# EAGLE design FlexWatch (EAGLE 9.5.0)
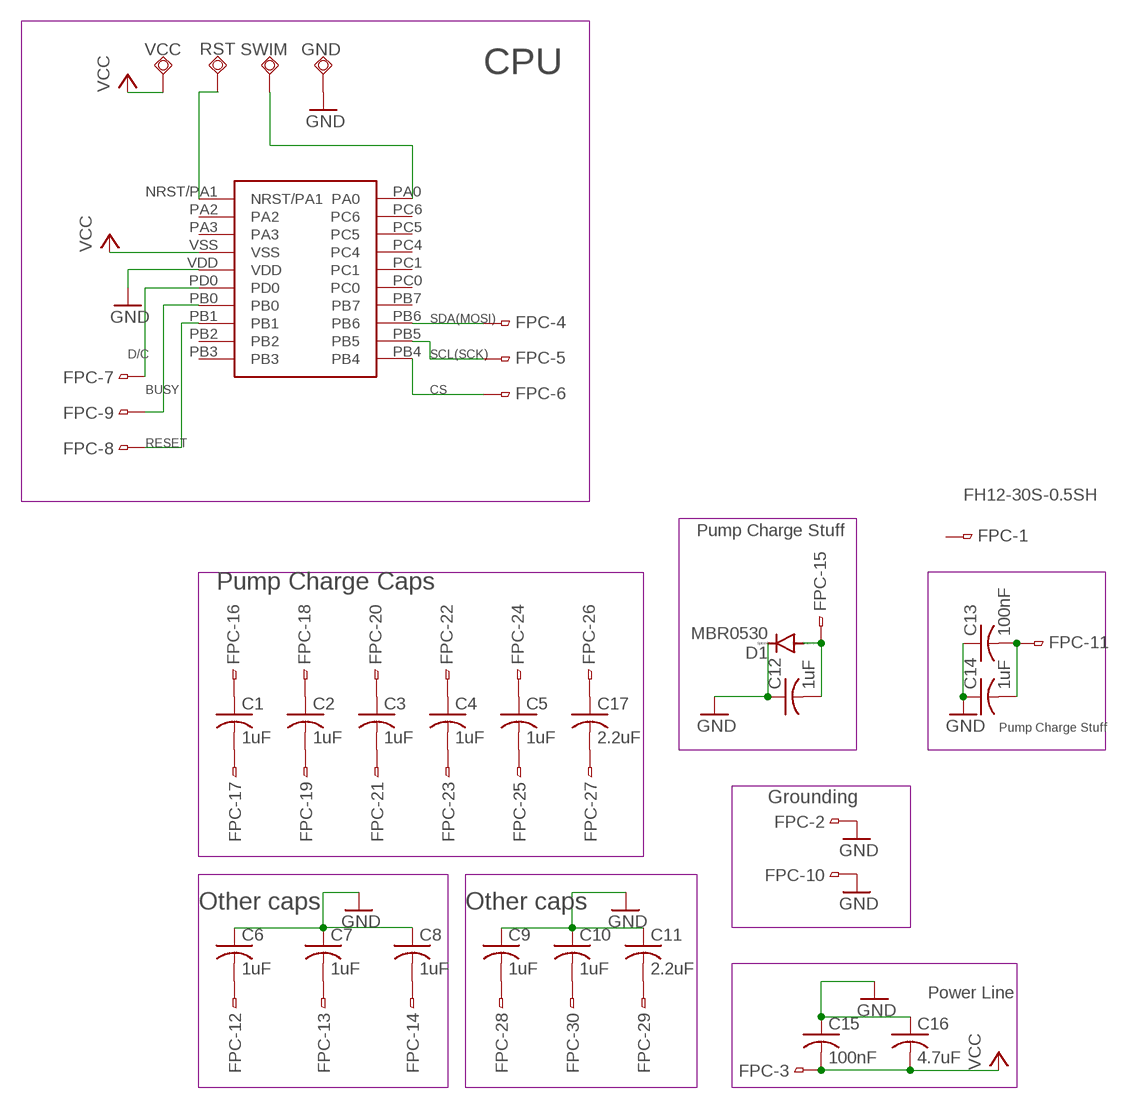
[diagram p0: schematic, sheet 1]

## Parts
C1  1uF  C-USC0805  [C0805]
C2  1uF  C-USC0805  [C0805]
C3  1uF  C-USC0805  [C0805]
C4  1uF  C-USC0805  [C0805]
C5  1uF  C-USC0805  [C0805]
C6  1uF  C-USC0805  [C0805]
C7  1uF  C-USC0805  [C0805]
C8  1uF  C-USC0805  [C0805]
C9  1uF  C-USC0805  [C0805]
C10  1uF  C-USC0805  [C0805]
C11  2.2uF  C-USC1206  [C1206]
C12  1uF  C-USC0805  [C0805]
C13  100nF  C-USC0805  [C0805]
C14  1uF  C-USC0805  [C0805]
C15  100nF  C-USC0805  [C0805]
C16  4.7uF  C-USC0805  [C0805]
C17  2.2uF  C-USC1206  [C1206]
D1  MBR0530  CGRM4001-G  [SOD-123_MINI-SMA]
FPC  FH12-30S-0.5SH  [FH12-30S-0.5SH]
GND  TPSQTP18SQ  [TP18SQ]
RST  TPSQTP18SQ  [TP18SQ]
SWIM  TPSQTP18SQ  [TP18SQ]
U$1  STM8L151F3  [UFQFPN-20]
VCC  TPSQTP18SQ  [TP18SQ]

## Nets
BUSY: FPC.9 U$1.PB0
CS: FPC.6 U$1.PB4
D/C: FPC.7 U$1.PD0
GND: C6.1 C7.1 C8.1 C9.1 C10.1 C11.1 C12.1 C13.1 C14.1 C15.1 C16.1 D1.C FPC.2 FPC.10 GND.TP U$1.VDD
N$1: C1.1 FPC.16
N$2: C1.2 FPC.17
N$3: C2.1 FPC.18
N$4: C2.2 FPC.19
N$5: C3.1 FPC.20
N$6: C3.2 FPC.21
N$7: C4.1 FPC.22
N$8: C4.2 FPC.23
N$9: C5.1 FPC.24
N$10: C5.2 FPC.25
N$11: C6.2 FPC.12
N$12: C7.2 FPC.13
N$13: C8.2 FPC.14
N$14: C12.2 D1.A FPC.15
N$15: C11.2 FPC.29
N$16: C9.2 FPC.28
N$17: C10.2 FPC.30
N$18: C13.2 C14.2 FPC.11
N$19: C17.1 FPC.26
N$20: C17.2 FPC.27
N$21: RST.TP U$1.NRST/PA1
N$22: SWIM.TP U$1.PA0
RESET: FPC.8 U$1.PB1
SCL(SCK): FPC.5 U$1.PB5
SDA(MOSI): FPC.4 U$1.PB6
VCC: C15.2 C16.2 FPC.3 U$1.VSS VCC.TP
Unconnected: FPC.1 U$1.PA2 U$1.PA3 U$1.PB2 U$1.PB3 U$1.PB7 U$1.PC0 U$1.PC1 U$1.PC4 U$1.PC5 U$1.PC6

## Notes on the sheet
- CPU
- Pump Charge Stuff
- Pump Charge Caps
- Pump Charge Stuff
- Grounding
- Other caps | Other caps
- Power Line

## Library data of the parts
C1-C17 = rcl:C-US: CAPACITOR, American symbol; SPICEPREFIX: C
D1 = diode:CGRM400*-G: Molded plasitc,JEDEC SOD-123/Mini SMA Source: Comchip CGRM4001-G.pdf
FPC = con-hirose:FH12-30S-0.5S: 0.5mm Pitch Connectors For FPC/FFC Source: Data sheet <http://www.hirose.co.jp/cataloge_hp/e58605370.pdf>; MPN: FH12-30S-0.5SH(55); OC_FARNELL: 1324555; OC_NEWARK: 34M6176
GND RST SWIM VCC = testpad:TPSQ: Test pad
U$1 = STM8L151F3:STM8L151F3: STM8L151F3 8bit mcuwith the 3x3 mm size !

## Board
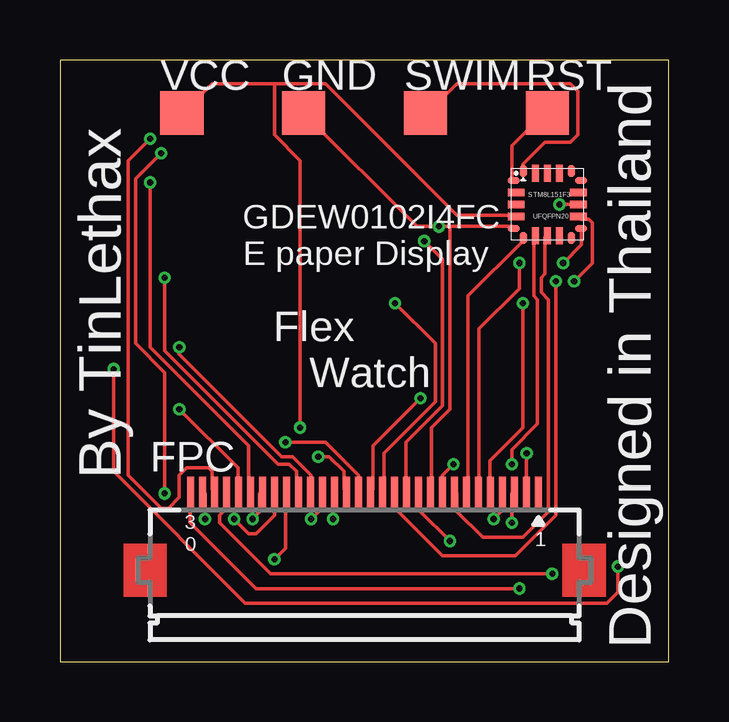
[diagram p1: board, top side]
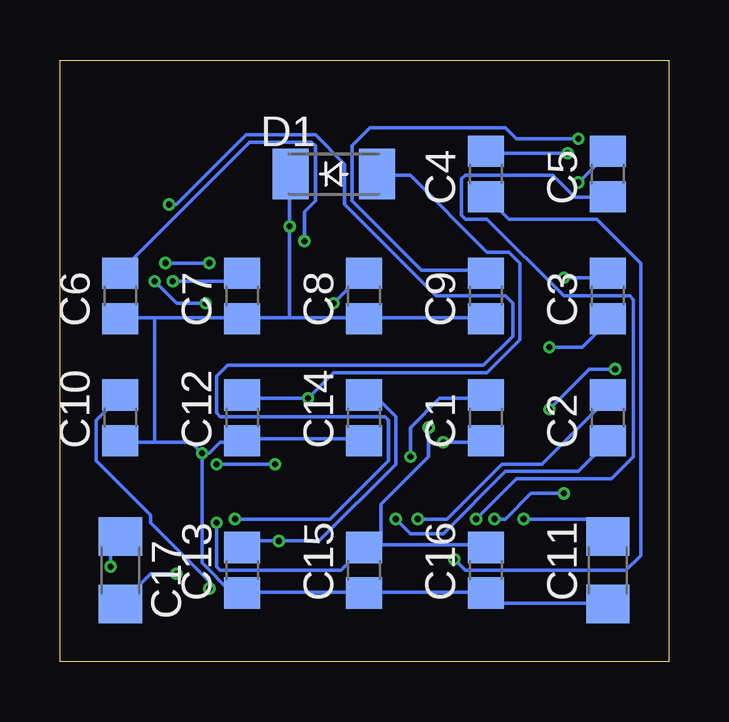
[diagram p2: board, bottom side, seen from below]

Size 25.38 x 25.07 mm. Coordinates in mm from the lower left corner, seen from the top.
Outline: 0,0 25.38,0 25.38,25.07 0,25.07 0,0
Copper layers (1*16): Top 0.035559375mm / dielectric 1.6mm / Bottom 0.035559375mm
Design rules "oshpark-2layer": minimum track width 6mil, minimum drill 10mil, track to track 6mil, track to pad 6mil, pad to pad 6mil, via to via 6mil, smd to smd 6mil, copper to edge 15mil, drill to drill 6mil, minimum pad ring 5mil, minimum via ring 5mil, stop-mask expansion 2.5mil, vias tented up to drill 0mil, thermal gap 10mil

### Footprints (pad centres in the part's own frame; a part is rotated, then mirrored left to right if it is on the bottom)
C0805 = smd 1.3 x 1.5: 1 -0.95,0; 2 0.95,0
C1206 = smd 1.6 x 1.8: 1 -1.4,0; 2 1.4,0
SOD-123_MINI-SMA = smd 1.5 x 2.1: A 1.8,0; C -1.8,0
FH12-30S-0.5SH = smd 0.3 x 1.3: 1 7.25,3.25; 2 6.75,3.25; 3 6.25,3.25; 4 5.75,3.25; 5 5.25,3.25; 6 4.75,3.25; 7 4.25,3.25; 8 3.75,3.25; 9 3.25,3.25; 10 2.75,3.25; 11 2.25,3.25; 12 1.75,3.25; 13 1.25,3.25; 14 0.75,3.25; 15 0.25,3.25; 16 -0.25,3.25; 17 -0.75,3.25; 18 -1.25,3.25; 19 -1.75,3.25; 20 -2.25,3.25; 21 -2.75,3.25; 22 -3.25,3.25; 23 -3.75,3.25; 24 -4.25,3.25; 25 -4.75,3.25; 26 -5.25,3.25; 27 -5.75,3.25; 28 -6.25,3.25; 29 -6.75,3.25; 30 -7.25,3.25
TP18SQ = smd 1.8 x 1.8: TP 0,0
UFQFPN-20 = smd 0.5 x 0.3: NRST/PA1 -1.4,1; PB4 1.4,-1; PC0 1.4,1; VDD -1.4,-1 | smd 0.3 x 0.5: PA0 -1,1.4; PB3 1,-1.4; PC1 1,1.4; PD0 -1,-1.4 | smd 0.7 x 0.3: PA2 -1.3,0.5; PA3 -1.3,0; PB5 1.3,-0.5; PB6 1.3,0; PB7 1.3,0.5; VSS -1.3,-0.5 | smd 0.3 x 0.7: PB0 -0.5,-1.3; PB1 0,-1.3; PB2 0.5,-1.3; PC4 0.5,1.3; PC5 0,1.3; PC6 -0.5,1.3

### Placement (x,y rotation side)
C1  7.62,10.16 90 bottom
C2  2.54,10.16 90 bottom
C3  2.54,15.24 90 bottom
C4  7.62,20.32 90 bottom
C5  2.54,20.32 90 bottom
C6  22.86,15.24 90 bottom
C7  17.78,15.24 90 bottom
C8  12.7,15.24 90 bottom
C9  7.62,15.24 90 bottom
C10  22.86,10.16 90 bottom
C11  2.54,3.81 90 bottom
C12  17.78,10.16 90 bottom
C13  17.78,3.81 90 bottom
C14  12.7,10.16 90 bottom
C15  12.7,3.81 90 bottom
C16  7.62,3.81 90 bottom
C17  22.86,3.81 270 bottom
D1  13.97,20.32 0 bottom
FPC  12.7,3.81 0 top
GND  10.16,22.86 0 top
RST  20.32,22.86 0 top
SWIM  15.24,22.86 0 top
U$1  20.32,19.05 0 top
VCC  5.08,22.86 0 top

### Tracks (layer width: path | path; a pad name or v marks a point on that pad's centre or on a via)
BUSY  (via drill 0.25)
  Top 0.152: v18.85,8.23 18.85,8.84 19.91,9.91 19.91,15.09 19.76,15.24 19.76,17.68 U$1.PB0 | v16.41,8.23 15.95,7.77 15.95,7.16 FPC.9
  Bottom 0.152: v16.41,8.23 v18.85,8.23
CS  (via drill 0.25)
  Top 0.152: v20.98,16.61 21.74,17.37 21.74,17.98 U$1.PB4 | v19.15,16.61 19.15,15.54 17.47,13.87 17.47,7.16 FPC.6
  Bottom 0.152: v19.15,16.61 v20.98,16.61
D/C
  Top 0.152: U$1.PD0 19.3,17.53 17.02,15.24 17.02,7.16 FPC.7
GND  (via drill 0.25)
  Top 0.152: 16.26,18.14 v15.8,18.14 14.88,18.14 GND.TP | 16.26,18.14 18.85,18.14 U$1.VDD | 16.26,18.14 16.26,10.52 15.49,9.75 15.49,7.16 FPC.10 | v19.46,8.69 19.46,7.16 FPC.2
  Bottom 0.152: 17.78,2.9 12.75,2.9 C15.1 12.6,2.9 7.72,2.9 C16.1 7.57,2.74 7.26,2.44 2.54,2.44 C11.1 | v19.46,8.69 19.15,8.69 18.69,9.14 17.78,9.14 C12.1 17.78,9.3 12.75,9.3 C14.1 | 21.44,9.14 19.91,9.14 v19.46,8.69 | 21.44,9.14 22.81,9.14 C10.1 | C9.1 7.72,14.33 12.6,14.33 C8.1 12.75,14.33 15.8,14.33 | 15.8,14.33 17.78,14.33 | 17.78,14.33 21.44,14.33 | 21.44,14.33 22.81,14.33 C6.1 | 17.78,14.33 C7.1 | 15.8,14.33 v15.8,18.14 15.8,20.27 D1.C | 21.44,14.33 21.44,9.14 | 17.78,2.9 18.24,2.9 19.46,4.12 v19.46,8.69 | 17.78,2.9 C13.1
N$1  (via drill 0.25)
  Top 0.152: v9.4,9.14 11.07,9.14 12.45,7.77 12.45,7.16 FPC.16
  Bottom 0.152: v9.4,9.14 7.72,9.14 C1.1
N$2  (via drill 0.25)
  Top 0.152: v10.77,8.53 11.23,8.53 11.84,7.92 11.84,7.16 FPC.17
  Bottom 0.152: v10.77,8.53 10.77,9.75 9.55,10.97 7.72,10.97 C1.2
N$3  (via drill 0.25)
  Top 0.152: v11.38,5.94 11.38,7.01 FPC.18
  Bottom 0.152: v11.38,5.94 10.77,5.33 9.4,5.33 6.81,7.92 3.76,7.92 2.54,9.14 C2.1
N$4  (via drill 0.25)
  Top 0.152: v10.46,5.94 10.92,6.4 10.92,7.01 FPC.19
  Bottom 0.152: v10.46,5.94 9.25,5.94 6.96,8.23 5.28,8.23 2.54,10.97 C2.2
N$5  (via drill 0.25)
  Top 0.152: v4.98,13.11 4.98,12.8 9.25,8.53 9.7,8.53 10.46,7.77 10.46,7.16 FPC.20
  Bottom 0.152: v4.98,13.11 3.61,13.11 2.54,14.17 C3.1
N$6  (via drill 0.25)
  Top 0.152: v4.37,16 4.37,12.95 9.09,8.23 9.55,8.23 9.85,7.92 9.85,7.16 FPC.21
  Bottom 0.152: v4.37,16 2.69,16 2.54,16.15 C3.2
N$7  (via drill 0.25)
  Top 0.152: v8.94,4.27 9.4,4.72 9.4,7.01 FPC.22
  Bottom 0.152: v8.94,4.27 8.48,3.81 1.78,3.81 1.17,4.42 1.17,16.61 3,18.44 6.65,18.44 7.57,19.36 C4.1
N$8  (via drill 0.25)
  Top 0.152: v7.26,5.94 7.87,5.33 8.18,5.33 8.94,6.1 8.94,7.01 FPC.23 | v4.37,7.01 4.37,12.04 3.15,13.26 3.15,20.12 v4.22,21.18
  Bottom 0.152: v7.26,5.94 6.81,5.94 5.74,7.01 v4.37,7.01 | v4.22,21.18 7.57,21.18 C4.2
N$9  (via drill 0.25)
  Top 0.152: v8.03,5.94 8.33,6.25 8.33,7.01 FPC.24
  Bottom 0.152: v8.03,5.94 6.35,7.62 2.39,7.62 1.47,8.53 1.47,15.09 1.63,15.24 4.37,15.24 7.57,18.44 8.48,18.44 8.64,18.59 8.64,20.12 8.48,20.27 4.83,20.27 3.91,19.36 2.54,19.36 C5.1
N$10  (via drill 0.25)
  Top 0.152: v3.76,19.96 3.76,13.11 7.87,8.99 7.87,7.16 FPC.25
  Bottom 0.152: v3.76,19.96 2.54,21.18 C5.2
N$11  (via drill 0.25)
  Top 0.152: v15.19,17.53 15.95,16.76 15.95,10.67 14.43,9.14 14.43,7.16 FPC.12
  Bottom 0.152: v15.19,17.53 15.19,18.75 14.73,19.2 14.73,21.49 14.88,21.64 17.47,21.64 22.81,16.31 C6.2
N$12  (via drill 0.25)
  Top 0.152: v20.68,15.85 20.68,6.1 19,4.42 15.95,4.42 13.97,6.4 13.97,7.01 FPC.13
  Bottom 0.152: v20.68,15.85 18.08,15.85 17.78,16.15 C7.2
N$13  (via drill 0.25)
  Top 0.152: v13.97,14.94 15.65,13.26 15.65,10.82 13.51,8.69 13.51,7.16 FPC.14
  Bottom 0.152: v13.97,14.94 12.75,16.15 C8.2
N$14  (via drill 0.25)
  Top 0.152: v15.04,10.97 13.06,8.99 13.06,7.16 FPC.15
  Bottom 0.152: C12.2 17.78,10.97 v15.04,10.97 13.97,12.04 7.57,12.04 6.2,13.41 6.2,16.61 6.65,17.07 7.57,17.07 10.77,20.27 12.14,20.27 D1.A
N$15  (via drill 0.25)
  Top 0.152: v6.04,5.94 6.04,7.01 FPC.29
  Bottom 0.152: v6.04,5.94 3.15,5.94 2.54,5.33 C11.2
N$16  (via drill 0.25)
  Top 0.152: v3.76,21.79 2.84,20.88 2.84,7.77 4.22,6.4 4.52,6.4 4.98,6.86 4.98,7.77 5.28,8.08 6.2,8.08 6.35,7.92 6.35,7.16 FPC.28
  Bottom 0.152: v3.76,21.79 6.35,21.79 6.81,22.25 12.45,22.25 13.21,21.49 13.21,19.2 10.31,16.31 7.72,16.31 C9.2
N$17  (via drill 0.25)
  Top 0.152: v19.15,3.05 8.18,3.05 5.44,5.79 5.44,7.01 FPC.30
  Bottom 0.152: v19.15,3.05 19.15,3.35 21.59,5.79 21.59,6.1 23.88,8.38 23.88,10.06 22.96,10.97 C10.2
N$18  (via drill 0.25)
  Top 0.152: v16.26,5.03 15.04,6.25 15.04,7.01 FPC.11
  Bottom 0.152: C13.2 17.78,4.88 17.63,5.03 v16.26,5.03 14.58,5.03 11.38,8.23 11.38,10.21 12.14,10.97 12.6,10.97 C14.2
N$19  (via drill 0.25)
  Top 0.152: v4.98,10.52 7.42,8.08 7.42,7.16 FPC.26 | v2.23,12.19 2.23,7.92 7.72,2.44 22.81,2.44 23.27,2.9 v23.27,3.96
  Bottom 0.152: v4.98,10.52 3.3,12.19 v2.23,12.19 | v23.27,3.96 23.27,4.88 22.96,5.18 C17.1
N$20  (via drill 0.25)
  Top 0.152: v20.52,3.66 8.79,3.66 6.65,5.79 6.65,6.1 6.96,6.4 6.96,7.01 FPC.27
  Bottom 0.152: v20.52,3.66 21.59,3.66 22.81,2.44 C17.2
N$21
  Top 0.152: U$1.NRST/PA1 18.85,20.12 18.85,21.49 20.22,22.86 RST.TP
N$22
  Top 0.152: U$1.PA0 19.3,20.57 19.3,20.73 20.22,21.64 21.28,21.64 21.59,21.95 21.59,23.77 21.28,24.08 16.56,24.08 15.34,22.86 SWIM.TP
RESET
  Top 0.152: U$1.PB1 20.22,17.68 20.22,16.15 20.07,16 20.07,15.39 20.37,15.09 20.37,6.25 19.3,5.18 17.63,5.18 16.56,6.25 16.56,7.01 FPC.8
SCL(SCK)  (via drill 0.25)
  Top 0.152: v21.44,15.85 22.2,16.61 22.2,18.29 22.05,18.44 21.74,18.44 U$1.PB5 | v19.3,14.94 19.3,9.75 17.93,8.38 17.93,7.16 FPC.5
  Bottom 0.152: v21.44,15.85 20.52,14.94 v19.3,14.94
SDA(MOSI)  (via drill 0.25)
  Top 0.152: v20.83,19.05 U$1.PB6 | v18.08,5.94 18.39,6.25 18.39,7.01 FPC.4
  Bottom 0.152: v20.83,19.05 20.52,19.05 17.63,21.95 14.73,21.95 13.51,20.73 13.51,19.05 9.7,15.24 6.81,15.24 6.5,14.94 6.5,13.56 7.72,12.34 18.39,12.34 18.85,11.89 18.85,10.36 18.69,10.21 11.84,10.21 11.68,10.06 11.68,8.38 14.12,5.94 v18.08,5.94
VCC  (via drill 0.25)
  Top 0.152: v18.85,5.79 18.85,7.01 FPC.3 | 8.94,24.08 6.35,24.08 5.13,22.86 VCC.TP | 8.94,24.08 11.07,24.08 16.56,18.59 19,18.59 U$1.VSS | v10.01,9.75 10.01,20.88 8.94,21.95 8.94,24.08
  Bottom 0.152: v18.85,5.79 18.85,3.96 18.69,3.81 13.66,3.81 12.75,4.72 C15.2 | 11.99,4.88 12.6,4.88 C15.2 | 11.99,4.88 7.72,4.88 C16.2 | 11.99,4.88 11.99,6.55 10.01,8.53 v10.01,9.75 | 11.99,4.88 C15.2

### Text on the board
tNames: Designed in Thailand | GDEW0102I4FC / E paper Display | Flex / Watch | By TinLethax